# Altium schematic sheet PushButtonQuadrant.SchDoc
size B; DocumentNumber: 5; SheetNumber: 5; SheetTotal: 6
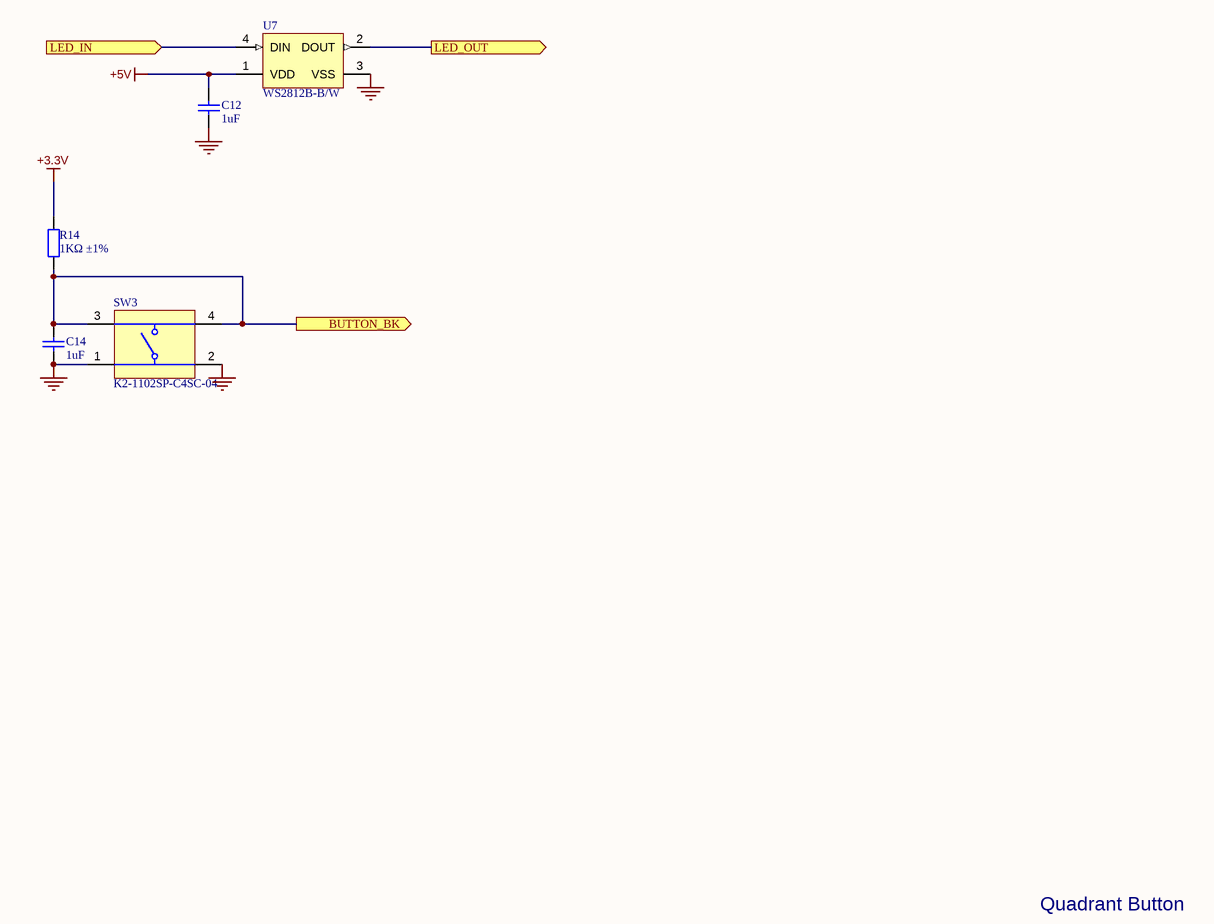
[diagram p0: PushButtonQuadrant.SchDoc]

## Parts
C12  1uF  [0603_C]
C14  1uF  [0603_C]
R14  1KΩ ±1%  [0603_R]
SW3  K2-1102SP-C4SC-04  [TECO-FSM4JSMATR_V]
U7  WS2812B-B/W  [ADA-RGB-1655_V]

## Ports
BUTTON_BK (out), LED_IN (in), LED_OUT (out)

## Nets
+3.3V: R14.1
+5V: C12.2 U7.1(VDD)
GND: C12.1 C14.2 SW3.1 SW3.2 U7.3(VSS)
BUTTON_BK: C14.1 R14.2 SW3.3 SW3.4 ; port BUTTON_BK
LED_IN: U7.4(DIN) ; port LED_IN
LED_OUT: U7.2(DOUT) ; port LED_OUT

## Notes on the sheet
- Quadrant Button
- SHEET
- Expatria Technologies
- 1136 Glade Court
- Port Coquitlam, BC V3B 1R5
- PROJECT
- SIZE
- ENGR
- MODIFIED
- DOCUMENT
- REV
- Copyright Expatria Technologies 2021.  This document describes Open Hardware and is licensed under the CERN-OHL-P  v2.  No warranty is implied or expressed.
- EMAIL: INFO@EXPATRIA.CA
- B
- /

## Library data of the parts
C12 C14 = 0603 1uF (105) 10% 50V: Chip capacitors; Manufacturer: Samsung Electro-Mechanics; PartNumber: CL10A105KB8NNNC; Tolerance: 10%; Voltage: 50V; ComponentLink1Description: Supplier link; ComponentLink1URL: http://www.szlcsc.com/product/details_16531.html; Package: 0603; Supplier: LC; SuppliersPartNumber: C15849; Capacitance: 1uF
R14 = 0603 1K (1001) 1%: Chip resistor; Manufacturer: Uniroyal Elec; PartNumber: 0603WAF1001T5E; Power: 1/10W; ComponentLink1Description: Supplier link; ComponentLink1URL: http://www.szlcsc.com/product/details_21904.html; Package: 0603; Supplier: LC; SuppliersPartNumber: C21190; Resistance: 1KΩ; Tolerance: 1%
SW3 = CMP-2000-07486-1: Top Actuated 50mA @ 12VDC Round Button SPST 6*6mm Tactile Switches ROHS; SuppliersPartNumber: C127509; Package: SMD-4_6.0x6.0x4.5P
U7 = CMP-2000-05026-1: Intelligent Control LED Integrated Light Source, 3.5 to 5.3 V, -25 to 80 degC, 4-Pin SMD, RoHS, Tape and Reel; Manufacturer: Worldsemi; Package Description: 4-Pin Surface Mount Device, Body 5 x 5 mm; SuppliersPartNumber: C2874885; Part_Number: WS2812B-B/W